# Altium project USB_power_meter_v2.PrjPcb
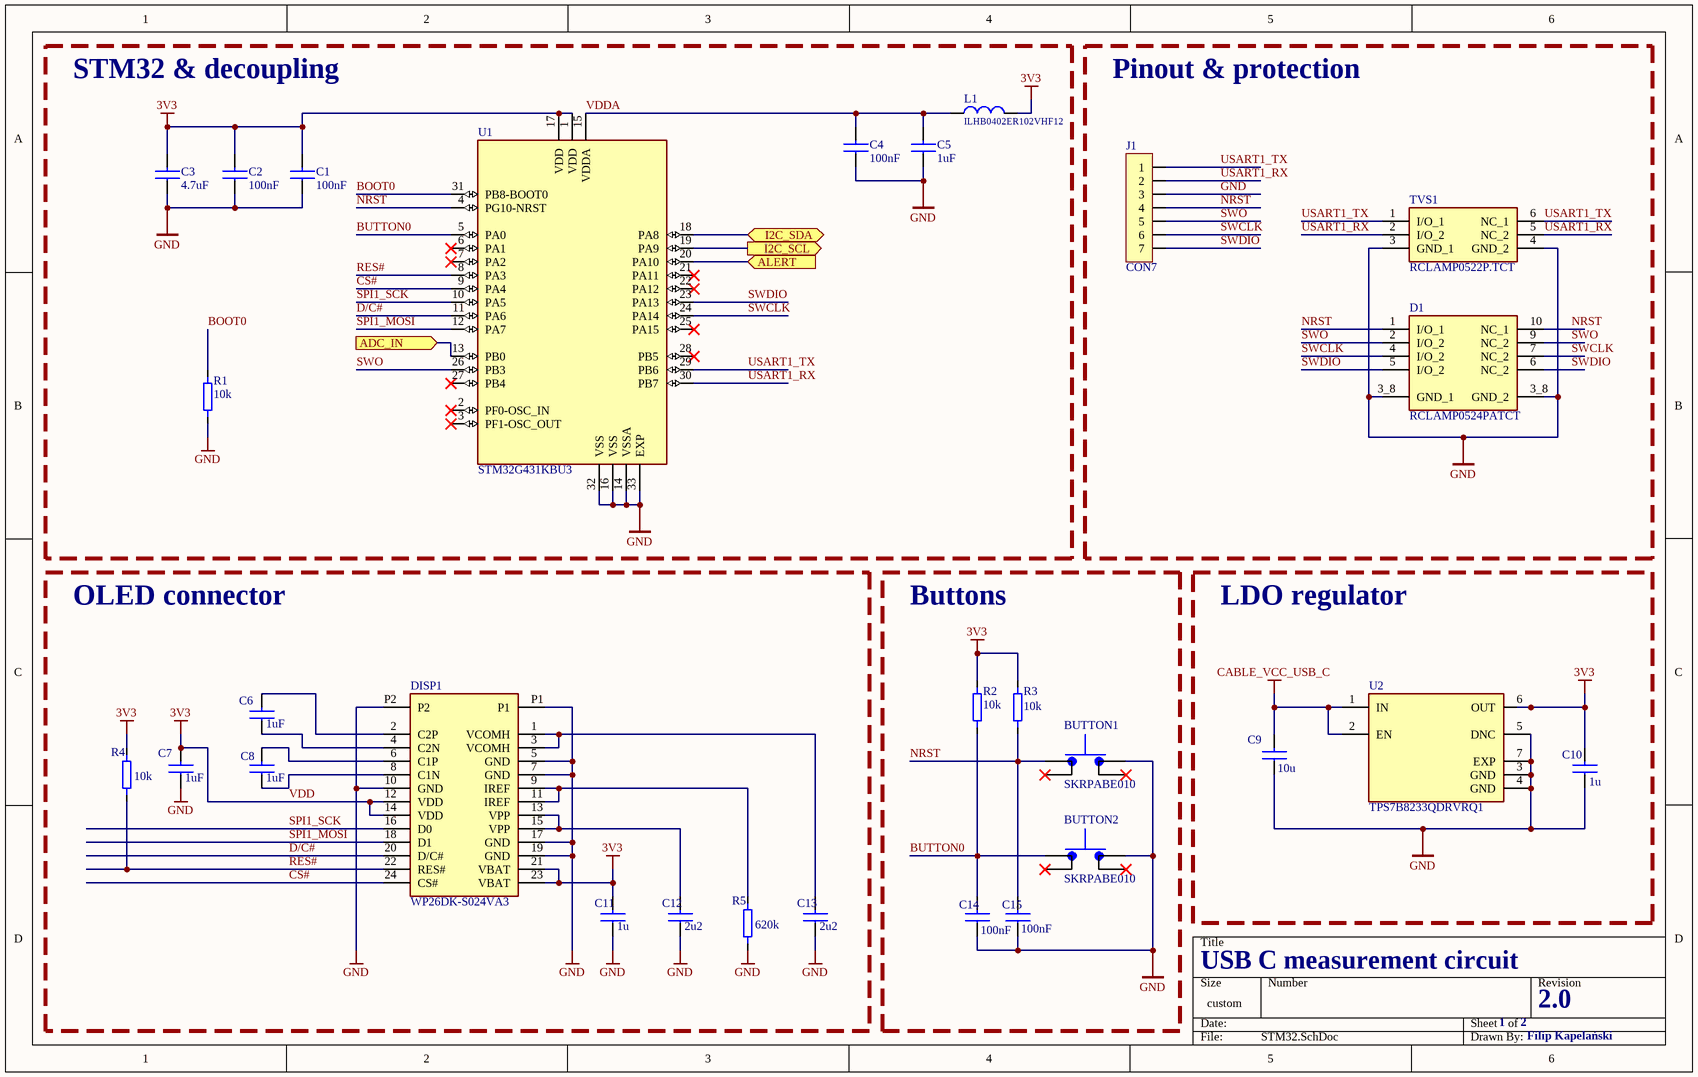
[diagram p0: STM32.SchDoc]
2 sheets, 48 parts. Net scope: flat (ports and power ports of the same name join across sheets).
Board file: USV_pwrmtr_V2.PcbDoc
Sheets:
  STM32.SchDoc
  MeasurementCircuit.SchDoc

## Sheet STM32.SchDoc
size 317 x 200 mm; SheetNumber: 1; SheetTotal: 2

### Parts
BUTTON1  SKRPABE010  [SKRPABE010]
BUTTON2  SKRPABE010  [SKRPABE010]
C1  100nF  [C0402]
C2  100nF  [C0402]
C3  4.7uF  [C0402]
C4  100nF  [C0402]
C5  1uF  [C0402]
C6  1uF  [C0402]
C7  1uF  [C0402]
C8  1uF  [C0402]
C9  10u  [C0402]
C10  1u  [C0402]
C11  1u  [C0402]
C12  2u2  [C0402]
C13  2u2  [C0402]
C14  100nF  [C0402]
C15  100nF  [C0402]
D1  RCLAMP0524PATCT  [DIO_RCLAMP0524PATCT]
DISP1  WP26DK-S024VA3  [WP26DK-S024VA3]
J1  CON7  [SIP7]
L1  ILHB0402ER102VHF12  [L0402]
R1  10k  [R0402]
R2  10k  [R0402]
R3  10k  [R0402]
R4  10k  [R0402]
R5  620k  [R0402]
TVS1  RCLAMP0522P.TCT  [RCLAMP0522PTCT]
U1  STM32G431KBU3  [STM32G431KBU3]
U2  TPS7B8233QDRVRQ1  [TPS7B8233QDRVRQ1]

### Blocks framed on the sheet
STM32 & decoupling: C1-C5 L1 R1 U1
Pinout & protection: D1 J1 TVS1
OLED connector: C6-C8 C11-C13 DISP1 R4 R5
Buttons: BUTTON1 BUTTON2 C14 C15 R2 R3
LDO regulator: C9 C10 U2

### Ports
ADC_IN (in, see MeasurementCircuit[3A]), ALERT (in, see MeasurementCircuit[3D]), I2C_SCL (out, see MeasurementCircuit[1D]), I2C_SDA (bidir, see MeasurementCircuit[1D])

### Nets
CABLE_VCC_USB_C: C9.2 U2.1(IN) U2.2(EN)
GND: BUTTON1.3 BUTTON2.3 C1.1 C2.1 C3.1 C4.1 C5.1 C7.1 C9.1 C10.1 C11.1 C12.1 C13.1 C14.1 C15.1 D1.3_8(GND_1) DISP1.5(GND) DISP1.7(GND) DISP1.10(GND) DISP1.17(GND) DISP1.19(GND) DISP1.P1 DISP1.P2 J1.3 R1.1 R5.2 TVS1.3(GND_1) TVS1.4(GND_2) U1.14(VSSA) U1.16(VSS) U1.32(VSS) U1.33(EXP) U2.3(GND) U2.4(GND) U2.5(DNC) U2.7(EXP)
VDD: C1.2 C2.2 C3.2 C7.2 C10.2 C11.2 DISP1.12(VDD) DISP1.14(VDD) DISP1.21(VBAT) DISP1.23(VBAT) L1.1 R2.1 R3.1 R4.1 U1.1(VDD) U1.17(VDD) U2.6(OUT)  [also labelled 3V3]
ADC1_IN15: U1.13(PB0) ; port ADC_IN
ALERT: U1.20(PA10) ; port ALERT
BOOT0: R1.2 U1.31(PB8-BOOT0)
BUTTON0: BUTTON2.1 C14.2 R2.2 U1.5(PA0)
CS#: DISP1.24(CS#) U1.9(PA4)
D/C#: DISP1.20(D/C#) U1.11(PA6)
I2C_SCL: U1.19(PA9) ; port I2C_SCL
I2C_SDA: U1.18(PA8) ; port I2C_SDA
NRST: BUTTON1.1 C15.2 D1.1(I/O_1) D1.10(NC_1) J1.4 R3.2 U1.4(PG10-NRST)
RES#: DISP1.22(RES#) R4.2 U1.8(PA3)
SPI1_MOSI: DISP1.18(D1) U1.12(PA7)
SPI1_SCK: DISP1.16(D0) U1.10(PA5)
SWCLK: D1.4(I/O_2) D1.7(NC_2) J1.6 U1.24(PA14)
SWDIO: D1.5(I/O_2) D1.6(NC_2) J1.7 U1.23(PA13)
SWO: D1.2(I/O_2) D1.9(NC_2) J1.5 U1.26(PB3)
USART1_RX: J1.2 TVS1.2(I/O_2) TVS1.5(NC_2) U1.30(PB7)
USART1_TX: J1.1 TVS1.1(I/O_1) TVS1.6(NC_1) U1.29(PB6)
VDDA: C4.2 C5.2 L1.2 U1.15(VDDA)
NetC6_1: C6.1 DISP1.4(C2N)
NetC6_2: C6.2 DISP1.2(C2P)
NetC8_1: C8.1 DISP1.8(C1N)
NetC8_2: C8.2 DISP1.6(C1P)
NetC12_2: C12.2 DISP1.13(VPP) DISP1.15(VPP)
NetC13_2: C13.2 DISP1.1(VCOMH) DISP1.3(VCOMH)
NetDISP1_9: DISP1.9(IREF) DISP1.11(IREF) R5.1

Not connected (* = marked no-connect by the designer): BUTTON1 2(1)* 4(2)*; BUTTON2 2(1)* 4(2)*; U1 2(PF0-OSC_IN)* 3(PF1-OSC_OUT)* 6(PA1)* 7(PA2)* 21(PA11)* 22(PA12)* 25(PA15)* 27(PB4)* 28(PB5)*

### Notes on the sheet
- USB C measurement circuit
- 1
- 2
- 2.0
- Filip Kapelański

### Library data of the parts
BUTTON1 BUTTON2 = SKRPABE010: Switch Tactile N.O. SPST Button J-Bend 0.05A 16VDC 1.57N SMD Automotive T/R
C1-C15 = C: Kondensator ceramiczny SMD; Supplier: *; SupplierURL: *; helpurl: *; Manufacturer: *; PartNumber: *; Price: *; Symbol: *; Package: *; Voltage: *
  C1 C2 C4 C14 C15: Value: 100nF
  C3: Value: 4.7uF
  C5-C8: Value: 1uF
  C9: Value: 10u
  C10 C11: Value: 1u
  C12 C13: Value: 2u2
D1 = RCLAMP0524PATCT: 15V Clamp 5A (8/20Âµs) Ipp Tvs Diode Surface Mount SLP2510P8; MF: Semtech Corporation; SnapEDA_Link: https://www.snapeda.com/parts/RCLAMP0524PATCT/Semtech+Corporation/view-part/?ref=snap; Package: UFDFN-10 Semtech; Value: *; MP: RCLAMP0524PATCT; Check_prices: https://www.snapeda.com/parts/RCLAMP0524PATCT/Semtech+Corporation/view-part/?ref=eda
J1 = CON7: Connector
L1 = L: Cewka/Koralik ferrytowy; Supplier: *; SupplierURL: *; helpurl: *; Manufacturer: *; Package: *; PartNumber: *; Price: *; Symbol: *; Value: ILHB0402ER102VHF12
R1-R5 = R: Rezystor SMD; helpurl: *; Manufacturer: *; PartNumber: *; Price: *; Symbol: *; Package: *; Supplier: *; SupplierURL: *
  R1-R4: Value: 10k
  R5: Value: 620k
TVS1 = RCLAMP0522P.TCT: TVS Diode (Bi-directional); Manufacturer_Name: SEMTECH; Datasheet Link: https://www.digikey.ph/en/products/detail/semtech-corporation/RCLAMP0522P-TCT/5113632; Height: 0.65mm; Manufacturer_Part_Number: RCLAMP0522P.TCT; Mouser Part Number: 947-RCLAMP0522P.TCT; Mouser Price/Stock: https://www.mouser.co.uk/ProductDetail/Semtech/RCLAMP0522P.TCT?qs=rBWM4%252BvDhIdKBWbIaH8MsA%3D%3D; Arrow Part Number: RCLAMP0522P.TCT; Arrow Price/Stock: https://www.arrow.com/en/products/rclamp0522p.tct/semtech?utm_currency=USD&region=nac
U1 = STM32G431KBU3: ARM® Cortex®-M4F STM32G4 Microcontroller IC 32-Bit Single-Core 170MHz 128KB (128K x 8) FLASH 32-UFQFPN (5x5); ComponentLink1Description: New link; ComponentLink1URL: https://www.mouser.pl/ProductDetail/STMicroelectronics/STM32G431KBU3?qs=PzGy0jfpSMtowkKWTRQBRw%3D%3D
U2 = TPS7B8233QDRVRQ1: WSON-6, Automotive 300-mA, off-battery (40-V), ultra-low-IQ LDO with enable in AEC-Q100 Grade-0 and Grade-1

## Sheet MeasurementCircuit.SchDoc
size 322 x 215 mm; SheetNumber: 2; SheetTotal: 2
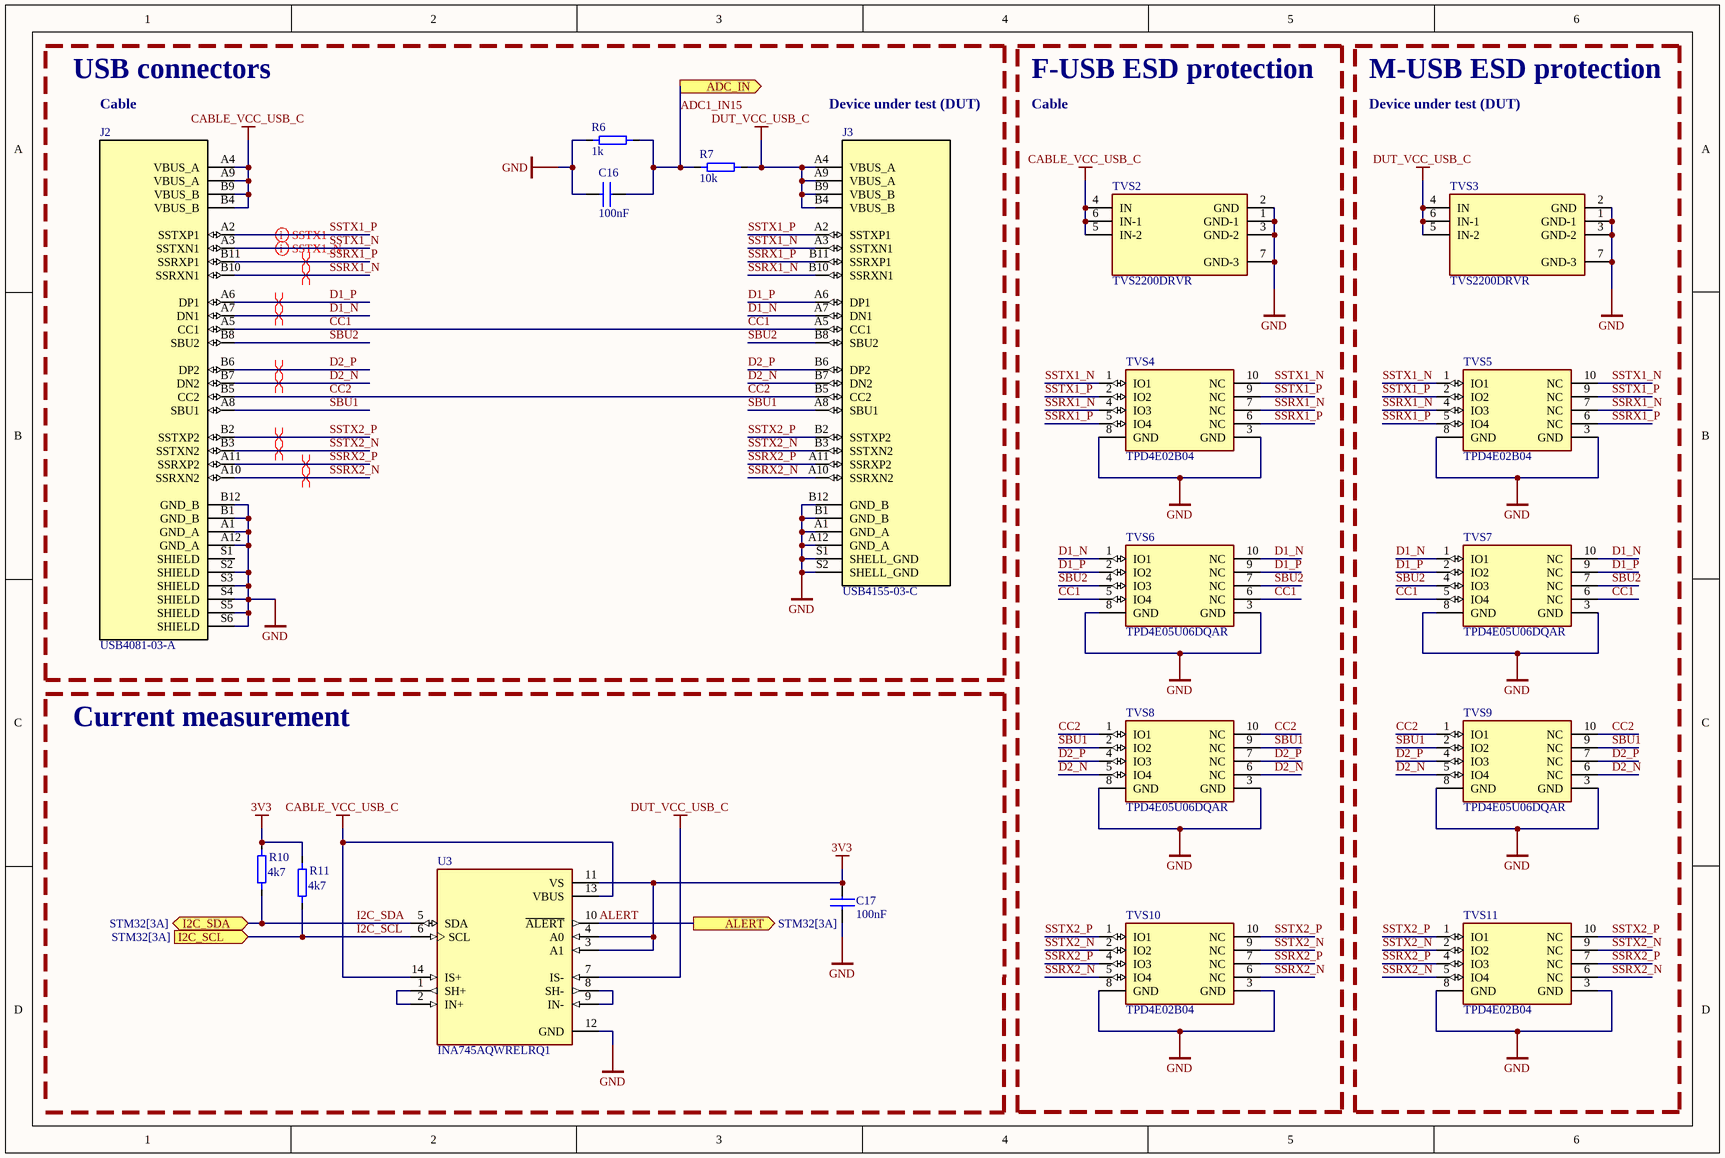
[diagram p1: MeasurementCircuit.SchDoc]

### Parts
C16  100nF  [C0402]
C17  100nF  [C0402]
J2  USB4081-03-A  [USB4081-03-A]
J3  USB4155-03-C  [USB4155-03-C]
R6  1k  [R0402]
R7  10k  [R0603]
R10  4k7  [R0402]
R11  4k7  [R0402]
TVS2  TVS2200DRVR  [TVS2200DRVR]
TVS3  TVS2200DRVR  [TVS2200DRVR]
TVS4  TPD4E02B04  [TPD4E02B04]
TVS5  TPD4E02B04  [TPD4E02B04]
TVS6  TPD4E05U06DQAR  [TPD4E05U06DQAR]
TVS7  TPD4E05U06DQAR  [TPD4E05U06DQAR]
TVS8  TPD4E05U06DQAR  [TPD4E05U06DQAR]
TVS9  TPD4E05U06DQAR  [TPD4E05U06DQAR]
TVS10  TPD4E02B04  [TPD4E02B04]
TVS11  TPD4E02B04  [TPD4E02B04]
U3  INA745AQWRELRQ1  [INA745AQWRELRQ1]

### Blocks framed on the sheet
USB connectors: C16 J2 J3 R6 R7
F-USB ESD protection: TVS2 TVS4 TVS6 TVS8 TVS10
M-USB ESD protection: TVS3 TVS5 TVS7 TVS9 TVS11

### Ports
ADC_IN (out, see STM32[2B]), ALERT (out, see STM32[3A]), I2C_SCL (in, see STM32[3A]), I2C_SDA (bidir, see STM32[3A])

### Nets
3V3: C17.1 R10.1 R11.1 U3.3(A1) U3.4(A0) U3.11(VS)  [project net VDD]
CABLE_VCC_USB_C: J2.A4(VBUS_A) J2.A9(VBUS_A) J2.B4(VBUS_B) J2.B9(VBUS_B) TVS2.4(IN) TVS2.5(IN-2) TVS2.6(IN-1) U3.13(VBUS) U3.14(IS+)
DUT_VCC_USB_C: J3.A4(VBUS_A) J3.A9(VBUS_A) J3.B4(VBUS_B) J3.B9(VBUS_B) R7.2 TVS3.4(IN) TVS3.5(IN-2) TVS3.6(IN-1) U3.7(IS-)
GND: C16.2 C17.2 J2.A1(GND_A) J2.A12(GND_A) J2.B1(GND_B) J2.B12(GND_B) J2.S2(SHIELD) J2.S3(SHIELD) J2.S4(SHIELD) J2.S5(SHIELD) J2.S6(SHIELD) J3.A1(GND_A) J3.A12(GND_A) J3.B1(GND_B) J3.B12(GND_B) J3.S1(SHELL_GND) J3.S2(SHELL_GND) R6.1 TVS2.1(GND-1) TVS2.2(GND) TVS2.3(GND-2) TVS2.7(GND-3) TVS3.1(GND-1) TVS3.2(GND) TVS3.3(GND-2) TVS3.7(GND-3) TVS4.3(GND) TVS4.8(GND) TVS5.3(GND) TVS5.8(GND) TVS6.3(GND) TVS6.8(GND) TVS7.3(GND) TVS7.8(GND) TVS8.3(GND) TVS8.8(GND) TVS9.3(GND) TVS9.8(GND) TVS10.3(GND) TVS10.8(GND) TVS11.3(GND) TVS11.8(GND) U3.12(GND)
ADC1_IN15: C16.1 R6.2 R7.1 ; port ADC_IN
ALERT: U3.10(~{ALERT}) ; port ALERT
CC1: J2.A5(CC1) J3.A5(CC1) TVS6.5(IO4) TVS6.6(NC) TVS7.5(IO4) TVS7.6(NC)
CC2: J2.B5(CC2) J3.B5(CC2) TVS8.1(IO1) TVS8.10(NC) TVS9.1(IO1) TVS9.10(NC)
D1_N: J2.A7(DN1) J3.A7(DN1) TVS6.1(IO1) TVS6.10(NC) TVS7.1(IO1) TVS7.10(NC)
D1_P: J2.A6(DP1) J3.A6(DP1) TVS6.2(IO2) TVS6.9(NC) TVS7.2(IO2) TVS7.9(NC)
D2_N: J2.B7(DN2) J3.B7(DN2) TVS8.5(IO4) TVS8.6(NC) TVS9.5(IO4) TVS9.6(NC)
D2_P: J2.B6(DP2) J3.B6(DP2) TVS8.4(IO3) TVS8.7(NC) TVS9.4(IO3) TVS9.7(NC)
I2C_SCL: R11.2 U3.6(SCL) ; port I2C_SCL
I2C_SDA: R10.2 U3.5(SDA) ; port I2C_SDA
SBU1: J2.A8(SBU1) J3.A8(SBU1) TVS8.2(IO2) TVS8.9(NC) TVS9.2(IO2) TVS9.9(NC)
SBU2: J2.B8(SBU2) J3.B8(SBU2) TVS6.4(IO3) TVS6.7(NC) TVS7.4(IO3) TVS7.7(NC)
SSRX1_N: J2.B10(SSRXN1) J3.B10(SSRXN1) TVS4.4(IO3) TVS4.7(NC) TVS5.4(IO3) TVS5.7(NC)
SSRX1_P: J2.B11(SSRXP1) J3.B11(SSRXP1) TVS4.5(IO4) TVS4.6(NC) TVS5.5(IO4) TVS5.6(NC)
SSRX2_N: J2.A10(SSRXN2) J3.A10(SSRXN2) TVS10.5(IO4) TVS10.6(NC) TVS11.5(IO4) TVS11.6(NC)
SSRX2_P: J2.A11(SSRXP2) J3.A11(SSRXP2) TVS10.4(IO3) TVS10.7(NC) TVS11.4(IO3) TVS11.7(NC)
SSTX1_N: J2.A3(SSTXN1) J3.A3(SSTXN1) TVS4.1(IO1) TVS4.10(NC) TVS5.1(IO1) TVS5.10(NC)
SSTX1_P: J2.A2(SSTXP1) J3.A2(SSTXP1) TVS4.2(IO2) TVS4.9(NC) TVS5.2(IO2) TVS5.9(NC)
SSTX2_N: J2.B3(SSTXN2) J3.B3(SSTXN2) TVS10.2(IO2) TVS10.9(NC) TVS11.2(IO2) TVS11.9(NC)
SSTX2_P: J2.B2(SSTXP2) J3.B2(SSTXP2) TVS10.1(IO1) TVS10.10(NC) TVS11.1(IO1) TVS11.10(NC)
NetU3_1: U3.1(SH+) U3.2(IN+)
NetU3_8: U3.8(SH-) U3.9(IN-)

Not connected (* = marked no-connect by the designer): J2 S1(SHIELD)

### Layout directives
differential pair: D1_N, D1_P, D2_N, D2_P, SSRX1_N, SSRX1_P, SSRX2_N, SSRX2_P, SSTX1_N, SSTX1_P, SSTX2_N, SSTX2_P

### Notes on the sheet
- Cable
- Device under test (DUT)
- Current measurement

### Library data of the parts
C16 C17 = C: Kondensator ceramiczny SMD; Supplier: *; SupplierURL: *; helpurl: *; Manufacturer: *; PartNumber: *; Price: *; Symbol: *; Package: *; Voltage: *; Value: 100nF
J2 = USB4081-03-A: Type C USB 3.2 Gen 2 Connector
J3 = USB4155-03-C: USB-C (USB TYPE-C) USB 3.2 Gen 2 (USB 3.1 Gen 2, Superspeed + (USB 3.1)) Receptacle Connector 24 Position Surface Mount, Right Angle; Through Hole
R6 R7 R10 R11 = R: Rezystor SMD; Supplier: *; SupplierURL: *; helpurl: *; Manufacturer: *; PartNumber: *; Price: *; Symbol: *; Package: *
  R6: Value: 1k
  R7: Value: 10k
  R10 R11: Value: 4k7
TVS2 TVS3 = TVS2200DRVR: 22V flat-clamp surge protection device; ComponentLink1Description: New link; ComponentLink1URL: https://www.mouser.pl/ProductDetail/Texas-Instruments/TVS2200DRVR?qs=W0yvOO0ixfHPbvei2cYdIw%3D%3D
TVS6-TVS9 = TPD4E05U06DQAR: ESD Protection Diodes / TVS Diodes 0.66-pF +/-3.6-V +/- 30-kV ESD protectio; ComponentLink1Description: New link; ComponentLink1URL: https://www.mouser.pl/ProductDetail/Texas-Instruments/TPD4E05U06DQAR?qs=%2FCrDlo5IrVPi4woOvWz0qA%3D%3D
U3 = INA745AQWRELRQ1: AEC-Q100 40V 16-bit high-precision I²C output digital power monitor with 800-µΩ EZShunt™ Technology; ComponentLink1Description: New link; ComponentLink1URL: https://www.digikey.com/en/products/detail/texas-instruments/INA745AQWRELRQ1/28022225
TVS4 TVS5 TVS10 TVS11 = TPD4E02B04: ComponentLink1Description: New link; ComponentLink1URL: https://www.mouser.pl/ProductDetail/Texas-Instruments/TPD4E02B04DQAR?qs=8%2FmU9qzJpL%2FFVYtHO1iV9g%3D%3D

## Nets that join several sheets
CABLE_VCC_USB_C: STM32 (C9.2 U2.1 U2.2), MeasurementCircuit (9 pins)
GND: STM32 (36 pins), MeasurementCircuit (43 pins)
VDD: STM32 (17 pins), MeasurementCircuit (6 pins)
ADC1_IN15: STM32 (U1.13), MeasurementCircuit (C16.1 R6.2 R7.1)
ALERT: STM32 (U1.20), MeasurementCircuit (U3.10)
I2C_SCL: STM32 (U1.19), MeasurementCircuit (R11.2 U3.6)
I2C_SDA: STM32 (U1.18), MeasurementCircuit (R10.2 U3.5)